# Altium schematic sheet ICSL_PS_CON.SchDoc
size A
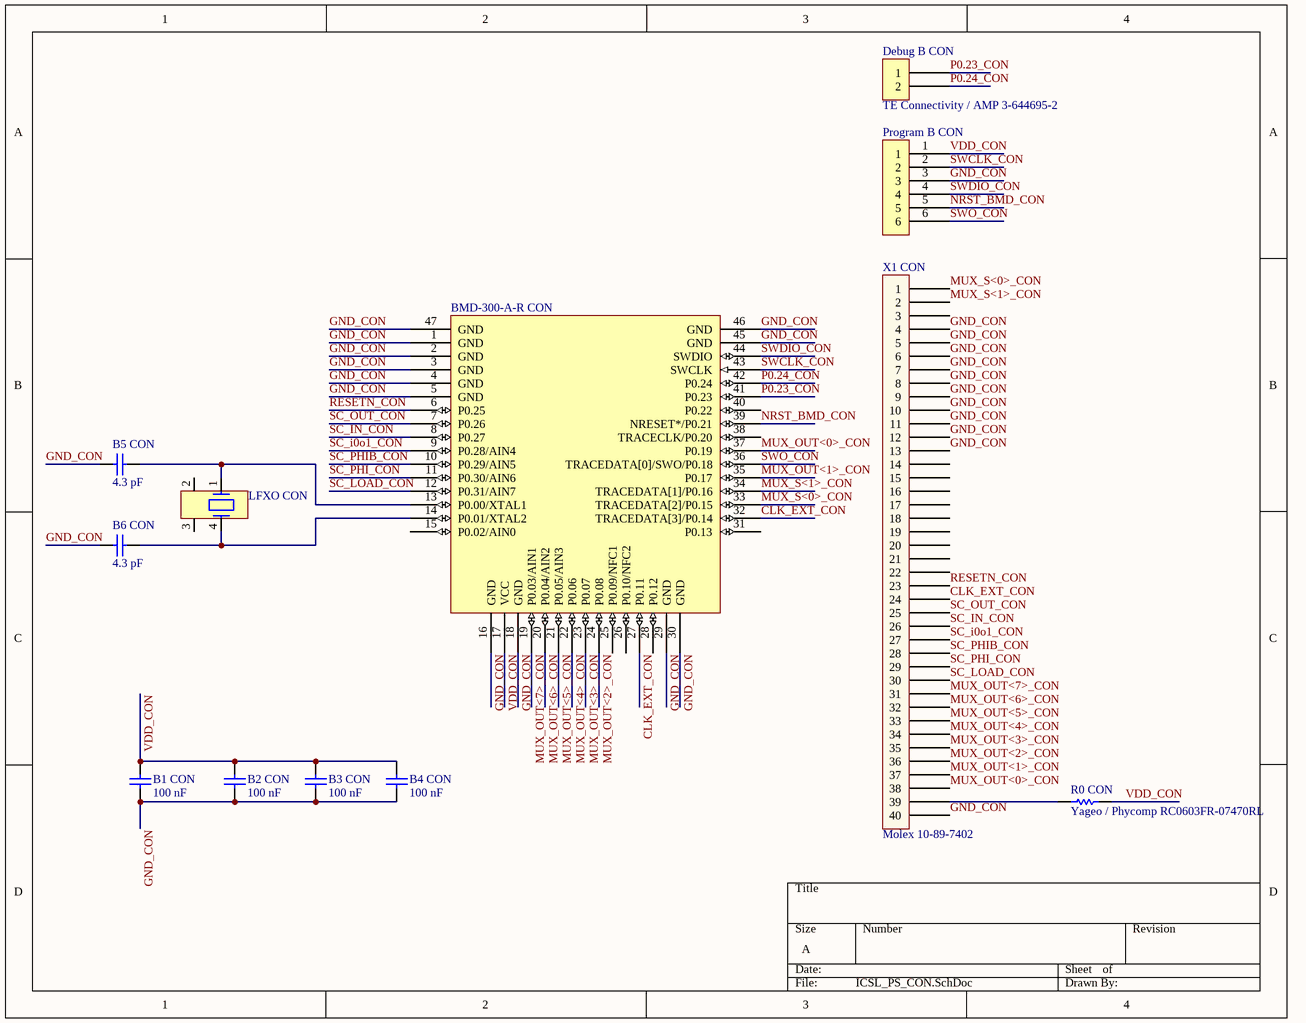
[diagram p0: ICSL_PS_CON.SchDoc]

## Parts
B1_CON  100 nF  [CAPC1608X90X35NL15T15]
B2_CON  100 nF  [CAPC1608X90X35NL15T15]
B3_CON  100 nF  [CAPC1608X90X35NL15T15]
B4_CON  100 nF  [CAPC1608X90X35NL15T15]
B5_CON  4.3 pF  [CAPC1608X90X35NL15T15]
B6_CON  4.3 pF  [CAPC1608X90X35NL15T15]
BMD-300-A-R_CON  Rigado BMD-300-A-R  [BMD-300 easy]  (value not drawn)
Debug_B_CON  TE Connectivity / AMP 3-644695-2  [PCB-i8m17woc8q0u0fbeoczf-1]
LFXO_CON  Abracon ABS25-32.768KHZ-6-T  [XTAL_4SM_8X3R8]  (value not drawn)
Program_B_CON  TE Connectivity / AMP 5-146281-6  [PCB-ceua2d6kgzjhmbkiz2sm-1]  (value not drawn)
R0_CON  Yageo / Phycomp RC0603FR-07470RL  [RESC1608X55X25LL10T15]
X1_CON  Molex 10-89-7402  [PCB-pj9c6d00mmo0g6kgjt7k-1]

## Nets
CLK_EXT_CON: BMD-300-A-R_CON.27(P0.11) BMD-300-A-R_CON.32(TRACEDATA[3]/P0.14) X1_CON.24
GND_CON: B1_CON.1 B2_CON.1 B3_CON.1 B4_CON.1 B5_CON.1 B6_CON.1 BMD-300-A-R_CON.1(GND) BMD-300-A-R_CON.2(GND) BMD-300-A-R_CON.3(GND) BMD-300-A-R_CON.4(GND) BMD-300-A-R_CON.5(GND) BMD-300-A-R_CON.16(GND) BMD-300-A-R_CON.18(GND) BMD-300-A-R_CON.29(GND) BMD-300-A-R_CON.30(GND) BMD-300-A-R_CON.45(GND) BMD-300-A-R_CON.46(GND) BMD-300-A-R_CON.47(GND) Program_B_CON.3 X1_CON.4 X1_CON.5 X1_CON.6 X1_CON.7 X1_CON.8 X1_CON.9 X1_CON.10 X1_CON.11 X1_CON.12 X1_CON.13 X1_CON.40
MUX_OUT<0>_CON: BMD-300-A-R_CON.37(P0.19) X1_CON.38
MUX_OUT<1>_CON: BMD-300-A-R_CON.35(P0.17) X1_CON.37
MUX_OUT<2>_CON: BMD-300-A-R_CON.24(P0.08) X1_CON.36
MUX_OUT<3>_CON: BMD-300-A-R_CON.23(P0.07) X1_CON.35
MUX_OUT<4>_CON: BMD-300-A-R_CON.22(P0.06) X1_CON.34
MUX_OUT<5>_CON: BMD-300-A-R_CON.21(P0.05/AIN3) X1_CON.33
MUX_OUT<6>_CON: BMD-300-A-R_CON.20(P0.04/AIN2) X1_CON.32
MUX_OUT<7>_CON: BMD-300-A-R_CON.19(P0.03/AIN1) X1_CON.31
MUX_S<0>_CON: BMD-300-A-R_CON.33(TRACEDATA[2]/P0.15) X1_CON.1
MUX_S<1>_CON: BMD-300-A-R_CON.34(TRACEDATA[1]/P0.16) X1_CON.2
NRST_BMD_CON: BMD-300-A-R_CON.39(NRESET*/P0.21) Program_B_CON.5
P0.23_CON: BMD-300-A-R_CON.41(P0.23) Debug_B_CON.1
P0.24_CON: BMD-300-A-R_CON.42(P0.24) Debug_B_CON.2
RESETN_CON: BMD-300-A-R_CON.6(P0.25) X1_CON.23
SC_i0o1_CON: BMD-300-A-R_CON.9(P0.28/AIN4) X1_CON.27
SC_IN_CON: BMD-300-A-R_CON.8(P0.27) X1_CON.26
SC_LOAD_CON: BMD-300-A-R_CON.12(P0.31/AIN7) X1_CON.30
SC_OUT_CON: BMD-300-A-R_CON.7(P0.26) X1_CON.25
SC_PHI_CON: BMD-300-A-R_CON.11(P0.30/AIN6) X1_CON.29
SC_PHIB_CON: BMD-300-A-R_CON.10(P0.29/AIN5) X1_CON.28
SWCLK_CON: BMD-300-A-R_CON.43(SWCLK) Program_B_CON.2
SWDIO_CON: BMD-300-A-R_CON.44(SWDIO) Program_B_CON.4
SWO_CON: BMD-300-A-R_CON.36(TRACEDATA[0]/SWO/P0.18) Program_B_CON.6
VDD_CON: B1_CON.2 B2_CON.2 B3_CON.2 B4_CON.2 BMD-300-A-R_CON.17(VCC) Program_B_CON.1 R0_CON.2
NetB5_CON_2: B5_CON.2 BMD-300-A-R_CON.13(P0.00/XTAL1) LFXO_CON.1
NetB6_CON_2: B6_CON.2 BMD-300-A-R_CON.14(P0.01/XTAL2) LFXO_CON.4
NetR0_CON_1: R0_CON.1 X1_CON.39

Not connected (* = marked no-connect by the designer): BMD-300-A-R_CON 15(P0.02/AIN0) 25(P0.09/NFC1) 26(P0.10/NFC2) 28(P0.12) 31(P0.13) 38(TRACECLK/P0.20) 40(P0.22); LFXO_CON 2 3; X1_CON 3 14 15 16 17 18 19 20 21 22

## Library data of the parts
B1_CON B2_CON B3_CON B4_CON = 06035A391GAT2A: CAP CER 390PF 50V 2% NP0 0603; Capacitance: 3.9e-10 F; Dielectric Characteristic: C0G/NP0; Lead-Free Status: Lead Free; Voltage Rating (DC): 50.0 V; Capacitance Tolerance: ±2%; Case/Package: 0603; Octopart Url: https://octopart.com/06035a391gat2a-avx+interconnect+%2F+elco-7765157; OctopartID: 340afd766dc9ebcd; Packaging: Tape; RoHS: Compliant
B5_CON B6_CON = CMP-175820-2: CAP CER 390PF 50V 2% NP0 0603; Capacitance: 3.9e-10 F; Dielectric Characteristic: C0G/NP0; Lead-Free Status: Lead Free; Voltage Rating (DC): 50.0 V; Capacitance Tolerance: ±2%; Case/Package: 0603; Octopart Url: https://octopart.com/06035a391gat2a-avx+interconnect+%2F+elco-7765157; OctopartID: 340afd766dc9ebcd; Packaging: Tape; RoHS: Compliant
BMD-300-A-R_CON = BMD-300-A-R: Mod Ble 4.2 Nordic Nrf52832 Soc; OctopartID: f77f3a358f6828b8; Octopart URL: http://octopart.com/bmd-300-a-r-rigado-71327089; Manufacturer Part Number: BMD-300-A-R
Debug_B_CON = CMP-2792ecc2f21af855-6: Connector Unshrouded Header 2 Position 2.54mm Solder Straight Thru-Hole; Voltage Rating (AC): 250 V; Number of Positions: 2; Mounting Angle: 180 °; Lead-Free Status: Lead Free; Shrouded: No; ELV Compliant: Compliant; Gender: Male; Flammability Rating: UL 94 V-0; Number of Rows: 1; Housing Color: Natural; Size-Width: 2.34 mm; Mounting Style: Through Hole; Orientation: Vertical; Lifecycle Status: Active; Manufacturer Part Number: 3-644695-2; OctopartID: 2792ecc2f21af855; RoHS: Compliant; Pin Pitch: 2.54 mm; Contact Plating: Tin; Housing Material: Polyester; Size-Length: 4.80 mm; Contact Material: Copper Alloy; Size-Height: 2.54 mm; Number of Contacts: 2; Packaging: Box, Bag; Octopart URL: http://octopart.com/3-644695-2-te+connectivity+%2F+amp-39514350
LFXO_CON = CMP-779567-4: ABS25 Series 32.768 kHz ±20 ppm 6 pF -40 to +85 °C SMT Low Frequency Crystal; Frequency: 32.8 kHz; Equivalent Series Resistance (ESR): 50.0 kΩ; Lead-Free Status: Lead Free; Load Capacitance: 6.00 pF; REACH SVHC Compliance: No SVHC; Mounting Style: Surface Mount; Seller Landing  Url: https://octopart-clicks.com/click/track?country=US&ak=8157f166&sig=0e47fd3&sid=1106&ppid=9289409&vpid=78496461&ct=offers; OctopartID: a1e368643a447e24; Octopart Url: http://octopart.com/abs25-32.768khz-6-t-abracon-9289409; Manufacturer Part Number: ABS25-32.768KHZ-6-T; RoHS: Compliant; Number of Pins: 4; Packaging: Cut Tape (CT)
Program_B_CON = 5-146281-2: Header; Breakaway; 0.100 in.; PC Board; Single; 6; 0.025 in.; 0.12 in.; 3 A; Gender: Male; Number of Contacts: 6; Lead-Free Status: Lead Free; ELV Compliant: Compliant; Lifecycle Status: Active; OctopartID: 4f28847cfb2a90ef; Manufacturer Part Number: 5-146281-2; Housing Color: Black; Flammability Rating: UL 94 V-0; Orientation: Vertical; Octopart URL: https://octopart.com/5-146281-6-te+connectivity+%2F+amp-40753677; Contact Plating: Tin, Tin over Nickel, Gold; Contact Material: Copper Alloy; RoHS: Compliant; Mounting Style: PCB
R0_CON = RC0603FR-07470RL: RES SMD 470 OHM 1% 1/10W 0603; Lead-Free Status: Lead Free; Power Rating: 0.1 W; Resistance: 470.0 Ω; Voltage Rating (DC): 50.0 V; Case/Package: 0603; Mounting Style: Surface Mount; Number of Pins: 2; Octopart Url: https://octopart.com/rc0603fr-07470rl-yageo-39823780; OctopartID: 0ba8c0fd876ad46f; REACH SVHC Compliance: No SVHC; Resistance Tolerance: ±1%; RoHS: Compliant; Size-Height: 0.00045 m; Size-Length: 0.0016 m; Size-Width: 0.0008 m
X1_CON = 10-89-7402: Conn Unshrouded Header HDR 40 POS 2.54mm Solder ST Thru-Hole Bag; Number of Circuits: 40; ELV Compliant: Compliant; Voltage Rating (DC): 250 V; Current Rating: 3.00 A; Gender: Male; Glow Wire Compliant: Non-Compliant; Lead-Free Status: Lead Free; Number of Positions: 40; Housing Material: Thermoplastic; RoHS: Compliant; Octopart URL: http://octopart.com/10-89-7402-molex-16617; Pin Pitch: 2.54 mm; Contact Material: Brass; Size-Width: 5.08 mm; Contact Plating: Gold; OctopartID: 87af4ea5e2205868; Orientation: Vertical; Number of Contacts: 40; Mounting Style: Through Hole, PCB, Vertical; Housing Color: Black; Flammability Rating: UL 94 V-0; Material: Copper Alloy; Packaging: Bag; Halogen Free Status: Low Halogen; Lifecycle Status: Active; Size-Height: 2.29 mm; Size-Length: 50.5 mm; Manufacturer Part Number: 10-89-7402; Number of Rows: 2